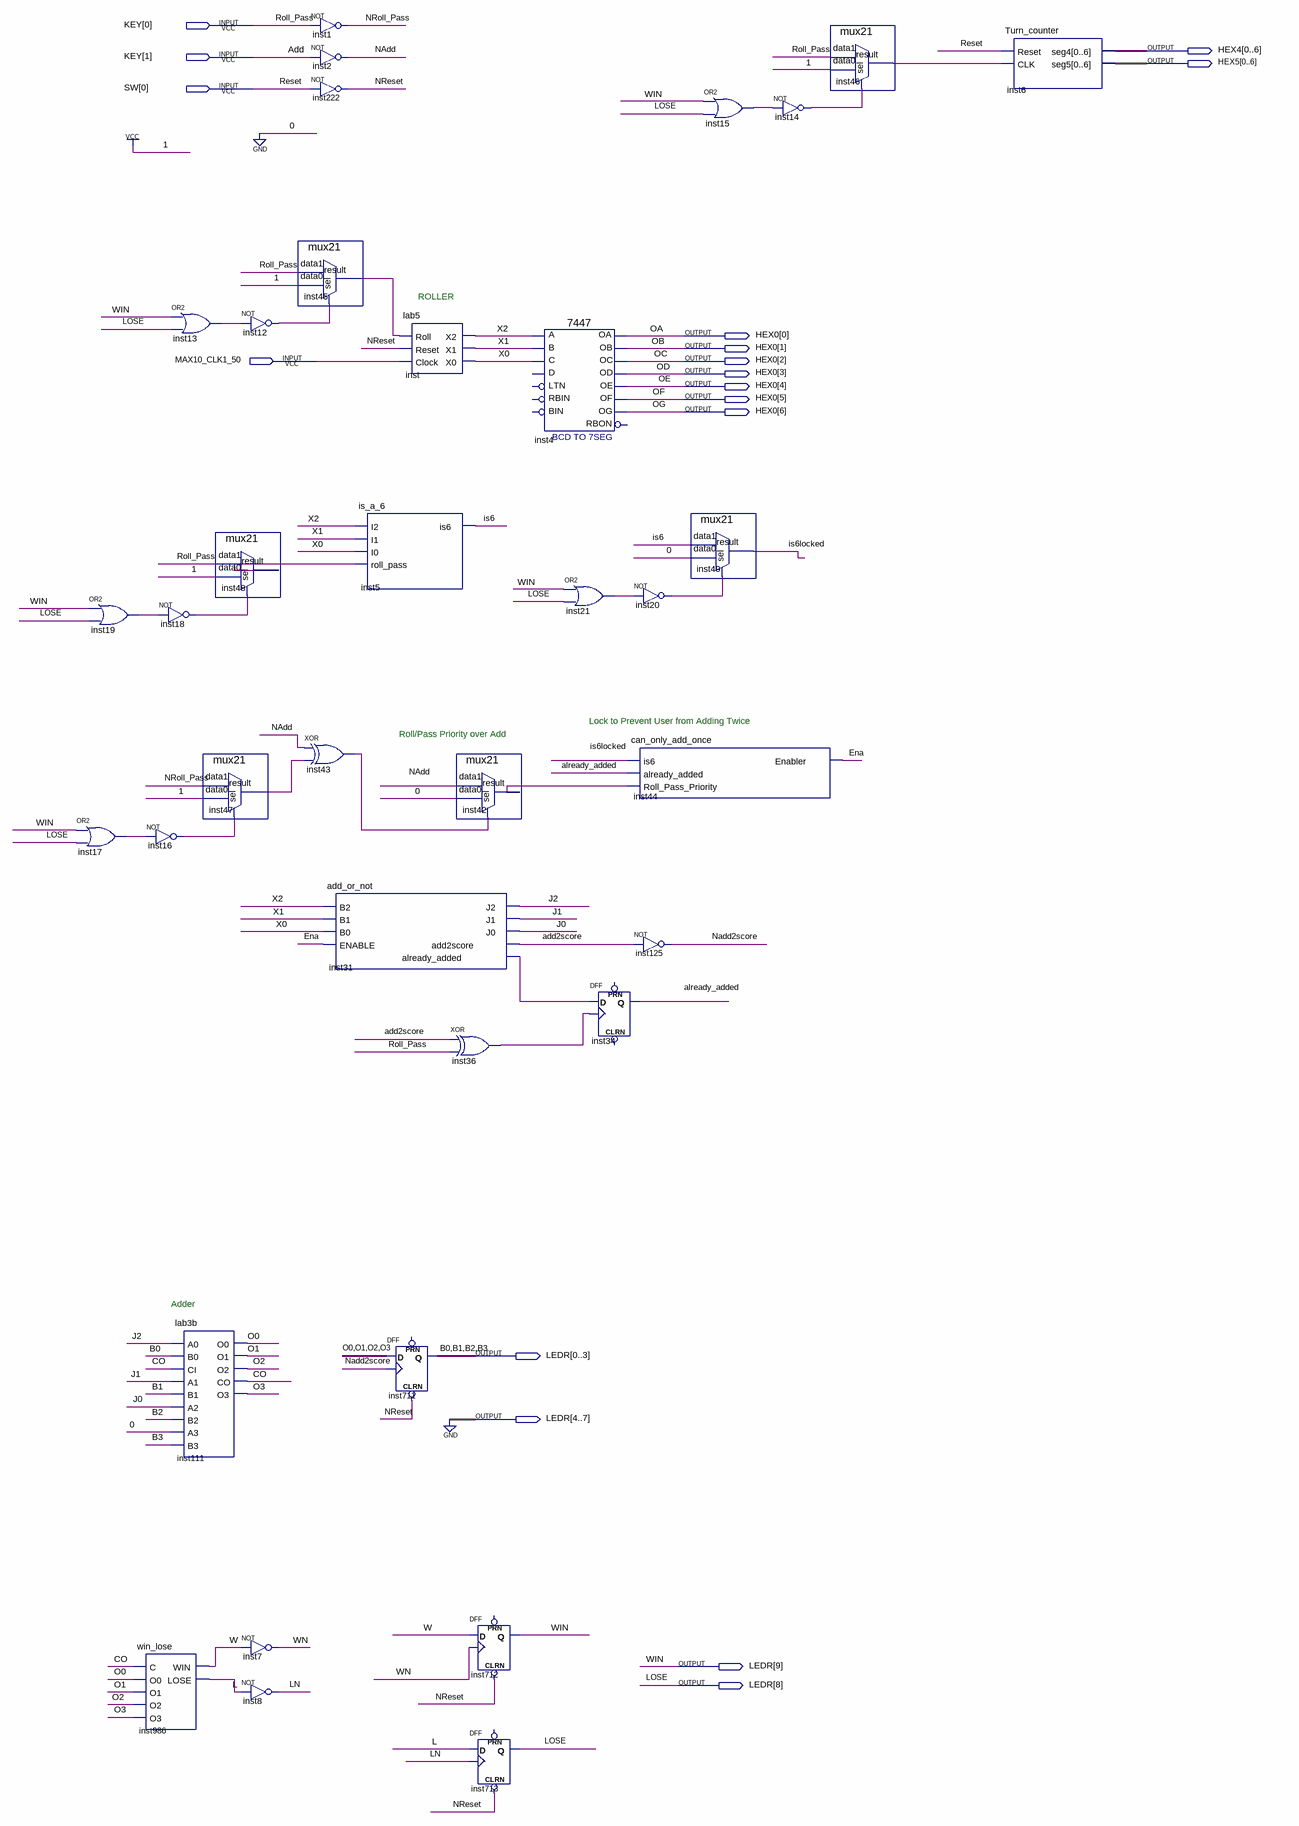
[diagram p0: schematic sheet]
// Quartus schematic lab6.bdf as structural Verilog: 36 symbols, 17 pins
module lab6 (
  input  [1:0] KEY,
  input  [0:0] SW,
  input  MAX10_CLK1_50,
  output [0:6] HEX4,
  output [0:6] HEX5,
  output [6:0] HEX0,
  output [0:9] LEDR
);

  wire add2score, already_added, CO, Ena, inst12_out, inst13_out, inst14_out, inst15_out, inst16_out,
       inst17_out, inst18_out, inst19_out, inst20_out, inst21_out, inst31_already_added, inst36_out,
       inst42_result, inst43_out, inst45_result, inst46_result, inst47_result, inst48_result, is6, is6locked,
       J0, J1, J2, L, LN, NAdd, Nadd2score, NReset, NRoll_Pass, O0, O1, O2, O3, W, WN, X0, X1, X2;

  or inst19 (inst19_out, LEDR[9], LEDR[8]);
  or inst17 (inst17_out, LEDR[9], LEDR[8]);
  win_lose inst986 (.C(CO), .O0(O0), .O1(O1), .O2(O2), .O3(O3), .WIN(W), .LOSE(L));
  or inst13 (inst13_out, LEDR[9], LEDR[8]);
  not inst18 (inst18_out, inst19_out);
  not inst16 (inst16_out, inst17_out);
  lab3b inst111 (
    .A0(J2), .B0(LEDR[0]), .CI(CO), .A1(J1), .B1(LEDR[1]), .A2(J0), .B2(LEDR[2]), .A3(1'b0), .B3(LEDR[3]),
    .O0(O0), .O1(O1), .O2(O2), .CO(CO), .O3(O3));
  not inst12 (inst12_out, inst13_out);
  mux21 inst48 (.data1(KEY[0]), .data0(1'b1), .sel(inst18_out), .result(inst48_result));
  mux21 inst47 (.data1(NRoll_Pass), .data0(1'b1), .sel(inst16_out), .result(inst47_result));
  not inst7 (WN, W);
  not inst8 (LN, L);
  not inst1 (NRoll_Pass, KEY[0]);
  not inst2 (NAdd, KEY[1]);
  not inst222 (NReset, SW[0]);
  mux21 inst45 (.data1(KEY[0]), .data0(1'b1), .sel(inst12_out), .result(inst45_result));
  xor inst43 (inst43_out, NAdd, inst47_result);
  add_or_not inst31 (
    .B2(X2), .B1(X1), .B0(X0), .ENABLE(Ena), .J2(J2), .J1(J1), .J0(J0), .add2score(add2score),
    .already_added(inst31_already_added));
  is_a_6 inst5 (.I2(X2), .I1(X1), .I0(X0), .roll_pass(inst48_result), .is6(is6));
  DFF inst711[3:0] (.CLRN(NReset), .CLK(Nadd2score), .D({O0, O1, O2, O3}), .Q(LEDR[0:3]));  // open: PRN
  lab5 inst (.Roll(inst45_result), .Reset(NReset), .Clock(MAX10_CLK1_50), .X2(X2), .X1(X1), .X0(X0));
  mux21 inst42 (.data1(NAdd), .data0(1'b0), .sel(inst43_out), .result(inst42_result));
  xor inst36 (inst36_out, add2score, KEY[0]);
  DFF inst712 (.CLRN(NReset), .CLK(WN), .D(W), .Q(LEDR[9]));  // open: PRN
  DFF inst713 (.CLRN(NReset), .CLK(LN), .D(L), .Q(LEDR[8]));  // open: PRN
  \7447  inst4 (
    .B(X1), .C(X0), .A(X2), .OB(HEX0[1]), .OC(HEX0[2]), .OE(HEX0[4]), .OD(HEX0[3]), .OF(HEX0[5]),
    .OG(HEX0[6]), .OA(HEX0[0]));  // open: LTN, D, RBIN, BIN, RBON
  or inst21 (inst21_out, LEDR[9], LEDR[8]);
  DFF inst34 (.CLK(inst36_out), .D(inst31_already_added), .Q(already_added));  // open: CLRN, PRN
  not inst20 (inst20_out, inst21_out);
  can_only_add_once inst44 (
    .is6(is6locked), .already_added(already_added), .Roll_Pass_Priority(inst42_result), .Enabler(Ena));
  not inst125 (Nadd2score, add2score);
  mux21 inst49 (.data1(is6), .data0(1'b0), .sel(inst20_out), .result(is6locked));
  or inst15 (inst15_out, LEDR[9], LEDR[8]);
  not inst14 (inst14_out, inst15_out);
  mux21 inst46 (.data1(KEY[0]), .data0(1'b1), .sel(inst14_out), .result(inst46_result));
  Turn_counter inst6 (.Reset(SW[0]), .CLK(inst46_result), .seg4(HEX4), .seg5(HEX5));

  assign LEDR[4:7] = 4'b0000;

  // Other names for the same wires on the sheet: Add = KEY[1]; B0 = LEDR[0]; B1 = LEDR[1]; B2 = LEDR[2]; B3 = LEDR[3];
  //   LOSE = LEDR[8]; OA = HEX0[0]; OB = HEX0[1]; OC = HEX0[2]; OD = HEX0[3]; OE = HEX0[4]; OF = HEX0[5];
  //   OG = HEX0[6]; Reset = SW[0]; Roll_Pass = KEY[0]; WIN = LEDR[9]

  // Notes on the sheet:
  //   ROLLER
  //   Lock to Prevent User from Adding Twice
  //   Roll/Pass Priority over Add
  //   Adder
endmodule
